# EAGLE design sensor_board (EAGLE 7.6.0)
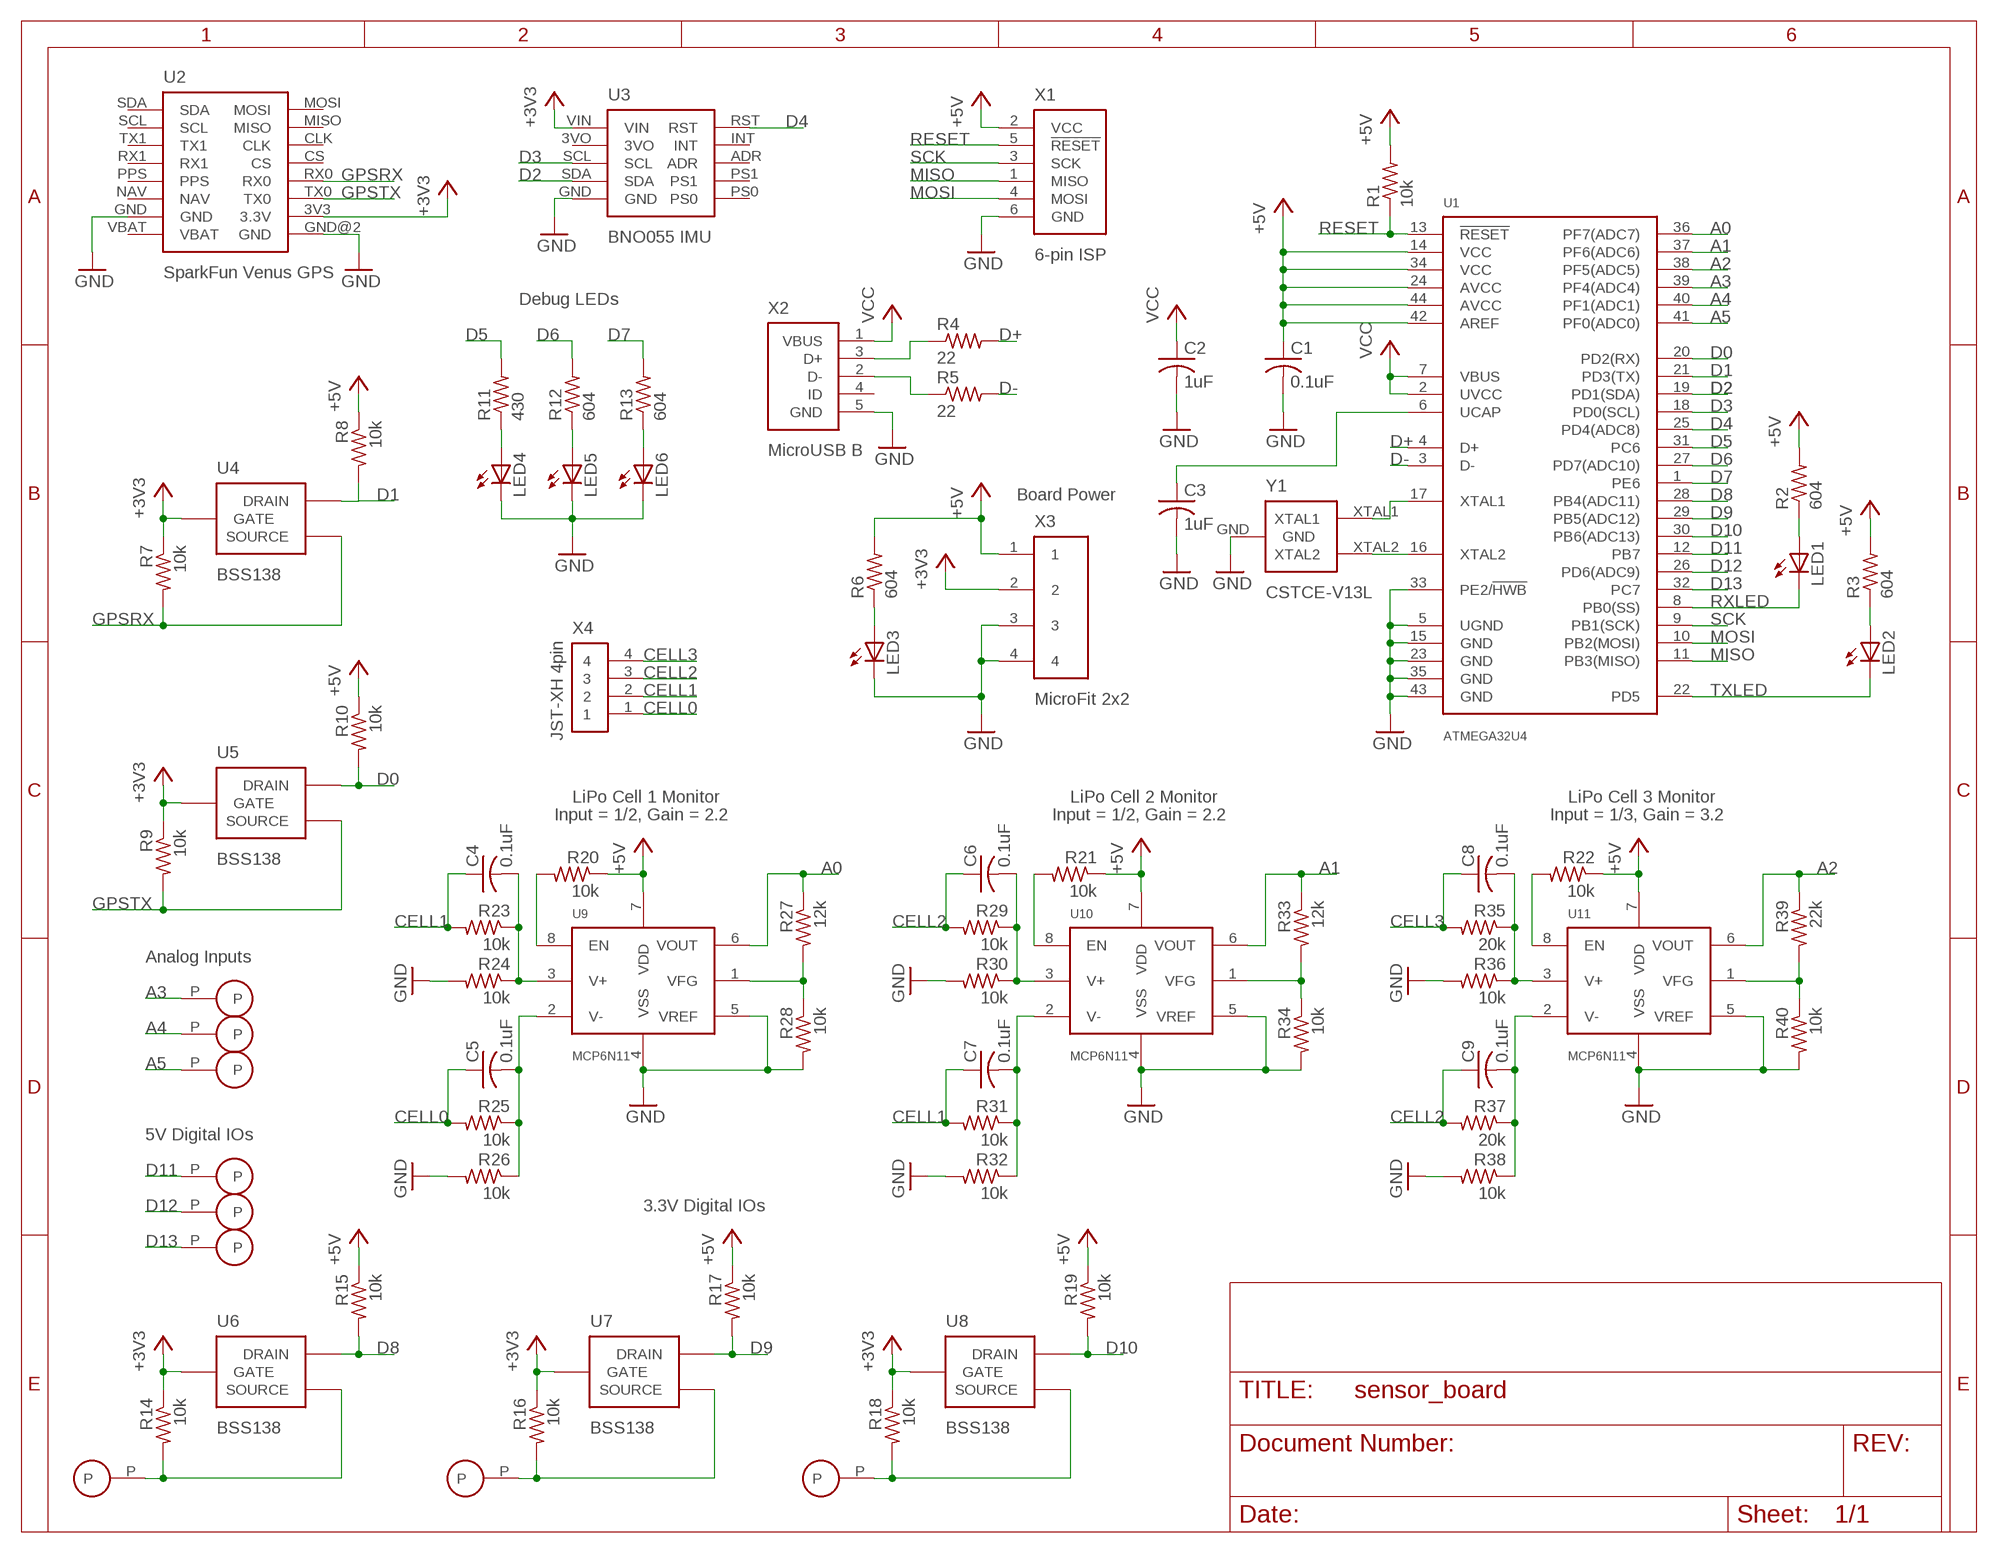
[diagram p0: schematic, sheet 1]

## Parts
C1  0.1uF  C-USC0603  [C0603]
C2  1uF  C-USC0603  [C0603]
C3  1uF  C-USC0603  [C0603]
C4  0.1uF  C-USC0603  [C0603]
C5  0.1uF  C-USC0603  [C0603]
C6  0.1uF  C-USC0603  [C0603]
C7  0.1uF  C-USC0603  [C0603]
C8  0.1uF  C-USC0603  [C0603]
C9  0.1uF  C-USC0603  [C0603]
LED1  LEDCHIPLED_0603  [CHIPLED_0603]
LED2  LEDCHIPLED_0603  [CHIPLED_0603]
LED3  LEDCHIPLED_0603  [CHIPLED_0603]
LED4  LEDCHIPLED_0603  [CHIPLED_0603]
LED5  LEDCHIPLED_0603  [CHIPLED_0603]
LED6  LEDCHIPLED_0603  [CHIPLED_0603]
P1  100MIL-PAD  [100MIL-PAD]
P2  100MIL-PAD  [100MIL-PAD]
P3  100MIL-PAD  [100MIL-PAD]
P4  100MIL-PAD  [100MIL-PAD]
P5  100MIL-PAD  [100MIL-PAD]
P6  100MIL-PAD  [100MIL-PAD]
P8  100MIL-PAD  [100MIL-PAD]
P9  100MIL-PAD  [100MIL-PAD]
P10  100MIL-PAD  [100MIL-PAD]
R1  10k  R-US_R0603  [R0603]
R2  604  R-US_R0603  [R0603]
R3  604  R-US_R0603  [R0603]
R4  22  R-US_R0603  [R0603]
R5  22  R-US_R0603  [R0603]
R6  604  R-US_R0603  [R0603]
R7  10k  R-US_R0603  [R0603]
R8  10k  R-US_R0603  [R0603]
R9  10k  R-US_R0603  [R0603]
R10  10k  R-US_R0603  [R0603]
R11  430  R-US_R0603  [R0603]
R12  604  R-US_R0603  [R0603]
R13  604  R-US_R0603  [R0603]
R14  10k  R-US_R0603  [R0603]
R15  10k  R-US_R0603  [R0603]
R16  10k  R-US_R0603  [R0603]
R17  10k  R-US_R0603  [R0603]
R18  10k  R-US_R0603  [R0603]
R19  10k  R-US_R0603  [R0603]
R20  10k  R-US_R0603  [R0603]
R21  10k  R-US_R0603  [R0603]
R22  10k  R-US_R0603  [R0603]
R23  10k  R-US_R0603  [R0603]
R24  10k  R-US_R0603  [R0603]
R25  10k  R-US_R0603  [R0603]
R26  10k  R-US_R0603  [R0603]
R27  12k  R-US_R0603  [R0603]
R28  10k  R-US_R0603  [R0603]
R29  10k  R-US_R0603  [R0603]
R30  10k  R-US_R0603  [R0603]
R31  10k  R-US_R0603  [R0603]
R32  10k  R-US_R0603  [R0603]
R33  12k  R-US_R0603  [R0603]
R34  10k  R-US_R0603  [R0603]
R35  20k  R-US_R0603  [R0603]
R36  10k  R-US_R0603  [R0603]
R37  20k  R-US_R0603  [R0603]
R38  10k  R-US_R0603  [R0603]
R39  22k  R-US_R0603  [R0603]
R40  10k  R-US_R0603  [R0603]
U1  ATMEGA32U4  [TQFP-44]
U2  SPARKFUN-VENUS-GPS  [SPARKFUN-VENUS-GPS]
U3  ADAFRUIT-BNO055-IMU  [ADAFRUIT-BNO055-IMU]
U4  BSS138  [SOT-23]
U5  BSS138  [SOT-23]
U6  BSS138  [SOT-23]
U7  BSS138  [SOT-23]
U8  BSS138  [SOT-23]
U9  MCP6N11  [SOIC-8]
U10  MCP6N11  [SOIC-8]
U11  MCP6N11  [SOIC-8]
X1  ISP-HEADER  [ISP-HEADER]
X2  MICRO-USB-B  [MICRO-USB-B]
X3  MICROFIT-2X2-SMD  [MICROFIT-2X2-0430450411]
X4  JST-XH-4  [JST-XH-4]
Y1  CSTCE-V13L  [CSTCE-V13L]

## Nets
3V3D8: P4.P R14.2 U6.SOURCE
3V3D9: P5.P R16.2 U7.SOURCE
3V3D10: P6.P R18.2 U8.SOURCE
+3V3: R7.1 R9.1 R14.1 R16.1 R18.1 U2.3V3(3.3V) U3.VIN U4.GATE U5.GATE U6.GATE U7.GATE U8.GATE X3.2
+5V: C1.1 R1.2 R2.2 R3.2 R6.2 R8.1 R10.1 R15.1 R17.1 R19.1 R20.1 R21.1 R22.1 U1.14(VCC) U1.24(AVCC) U1.34(VCC) U1.42(AREF) U1.44(AVCC) U9.7(VDD) U10.7(VDD) U11.7(VDD) X1.2(VCC) X3.1
A0: R27.1 U1.36(PF7(ADC7)) U9.6(VOUT)
A1: R33.1 U1.37(PF6(ADC6)) U10.6(VOUT)
A2: R39.1 U1.38(PF5(ADC5)) U11.6(VOUT)
A3: P8.P U1.39(PF4(ADC4))
A4: P9.P U1.40(PF1(ADC1))
A5: P10.P U1.41(PF0(ADC0))
CELL0: C5.1 R25.2 X4.1
CELL1: C4.1 C7.1 R23.2 R31.2 X4.2
CELL2: C6.1 C9.1 R29.2 R37.2 X4.3
CELL3: C8.1 R35.2 X4.4
D0: R10.2 U1.20(PD2(RX)) U5.DRAIN
D1: R8.2 U1.21(PD3(TX)) U4.DRAIN
D2: U1.19(PD1(SDA)) U3.SDA
D3: U1.18(PD0(SCL)) U3.SCL
D4: U1.25(PD4(ADC8)) U3.RST
D5: R11.2 U1.31(PC6)
D6: R12.2 U1.27(PD7(ADC10))
D7: R13.2 U1.1(PE6)
D8: R15.2 U1.28(PB4(ADC11)) U6.DRAIN
D9: R17.2 U1.29(PB5(ADC12)) U7.DRAIN
D10: R19.2 U1.30(PB6(ADC13)) U8.DRAIN
D11: P1.P U1.12(PB7)
D12: P2.P U1.26(PD6(ADC9))
D13: P3.P U1.32(PC7)
D+: R4.2 U1.4(D+)
D-: R5.2 U1.3(D-)
GND: C1.2 C2.2 C3.2 LED3.C LED4.C LED5.C LED6.C R24.2 R26.2 R28.2 R30.2 R32.2 R34.2 R36.2 R38.2 R40.2 U1.5(UGND) U1.15(GND) U1.23(GND) U1.33(PE2/!HWB!) U1.35(GND) U1.43(GND) U2.GND U2.GND@2(GND) U3.GND U9.4(VSS) U9.5(VREF) U10.4(VSS) U10.5(VREF) U11.4(VSS) U11.5(VREF) X1.6(GND) X2.5(GND) X3.3 X3.4 Y1.GND
GPSRX: R7.2 U2.RX0 U4.SOURCE
GPSTX: R9.2 U2.TX0 U5.SOURCE
MISO: U1.11(PB3(MISO)) X1.1(MISO)
MOSI: U1.10(PB2(MOSI)) X1.4(MOSI)
N$1: LED3.A R6.1
N$2: C3.1 U1.6(UCAP)
N$3: LED1.A R2.1
N$4: LED2.A R3.1
N$5: U1.16(XTAL2) Y1.XTAL2
N$6: U1.17(XTAL1) Y1.XTAL1
N$7: R20.2 U9.8(EN)
N$8: R5.1 X2.2(D-)
N$9: R4.1 X2.3(D+)
N$10: LED4.A R11.1
N$11: LED5.A R12.1
N$12: LED6.A R13.1
N$13: R21.2 U10.8(EN)
N$14: R22.2 U11.8(EN)
N$15: C4.2 R23.1 R24.1 U9.3(V+)
N$16: C8.2 R35.1 R36.1 U11.3(V+)
N$17: C5.2 R25.1 R26.1 U9.2(V-)
N$18: C6.2 R29.1 R30.1 U10.3(V+)
N$19: R27.2 R28.1 U9.1(VFG)
N$21: C7.2 R31.1 R32.1 U10.2(V-)
N$22: C9.2 R37.1 R38.1 U11.2(V-)
N$24: R33.2 R34.1 U10.1(VFG)
N$25: R39.2 R40.1 U11.1(VFG)
RESET: R1.1 U1.13(!RESET!) X1.5(!RESET!)
RXLED: LED1.C U1.8(PB0(SS))
SCK: U1.9(PB1(SCK)) X1.3(SCK)
TXLED: LED2.C U1.22(PD5)
VCC: C2.1 U1.2(UVCC) U1.7(VBUS) X2.1(VBUS)
Unconnected: U2.CLK U2.CS U2.MISO U2.MOSI U2.NAV U2.PPS U2.RX1 U2.SCL U2.SDA U2.TX1 U3.ADR U3.INT U3.PS0 U3.PS1 X2.4(ID)

## Notes on the sheet
- Debug LEDs
- Board Power
- LiPo Cell 1 Monitor | LiPo Cell 2 Monitor | LiPo Cell 3 Monitor
- Input = 1/2, Gain = 2.2 | Input = 1/2, Gain = 2.2 | Input = 1/3, Gain = 3.2
- Analog Inputs
- 5V Digital IOs
- 3.3V Digital IOs

## Power pins joined to a net without a drawn wire
3VO: U3.3VO
VBAT: U2.VBAT

## Library data of the parts
C1-C9 = resistor:C-US: CAPACITOR, American symbol
LED1-LED6 = led:LED: LED OSRAM: - CHIPLED LG R971, LG N971, LY N971, LG Q971, LY Q971, LO R971, LY R971 LH N974, LH R974 LS Q976, LO Q976, LY Q976 LO Q996 - Hyper CHIPLED LW Q18S LB Q993, LB Q99A, LB R99A - SideLED LS A670, LO A670, LY A670, LG A670, LP A670 LB A673, LV A673, LT A673, LW A673 LH A674 LY A675 LS A676, LA A676, LO A676, LY A676, LW A676 LS A679, LY A679, LG A679 - Hyper Micro SIDELED® LS Y876, LA Y876, LO Y876, LY Y876 LT Y87S - SmartLED LW L88C, LW L88S LB L89C, LB L89S, LG L890 LS L89K, LO L89K, LY L89K LS L896, LA L896, LO L896, LY L896 - TOPLED LS T670, LO T670, LY T670, LG T670, LP T670 LSG T670, LSP T670, LSY T670, LOP T670, LYG T670 LG T671, LOG T671, LSG T671 LB T673, LV T673, LT T673, LW T673 LH T674 LS T676, LA T676, LO T676, LY T676, LB T676, LH T676, LSB T676, LW T676 LB T67C, LV T67C, LT T67C, LS T67K, LO T67K, LY T67K, LW E67C LS E67B, LA E67B, LO E67B, LY E67B, LB E67C, LV E67C, LT E67C LW T67C LS T679, LY T679, LG T679 LS T770, LO T770, LY T770, LG T770, LP T770 LB T773, LV T773, LT T773, LW T773 LH T774 LS E675, LA E675, LY E675, LS T675 LS T776, LA T776, LO T776, LY T776, LB T776 LHGB T686 LT T68C, LB T68C - Hyper Mini TOPLED® LB M676 - Mini TOPLED Santana® LG M470 LS M47K, LO M47K, LY M47K Source: http://www.osram.convergy.de LUXEON: - LUMILED® LXK2-PW12-R00, LXK2-PW12-S00, LXK2-PW14-U00, LXK2-PW14-V00 LXK2-PM12-R00, LXK2-PM12-S00, LXK2-PM14-U00 LXK2-PE12-Q00, LXK2-PE12-R00, LXK2-PE12-S00, LXK2-PE14-T00, LXK2-PE14-U00 LXK2-PB12-K00, LXK2-PB12-L00, LXK2-PB12-M00, LXK2-PB14-N00, LXK2-PB14-P00, LXK2-PB14-Q00 LXK2-PR12-L00, LXK2-PR12-M00, LXK2-PR14-Q00, LXK2-PR14-R00 LXK2-PD12-Q00, LXK2-PD12-R00, LXK2-PD12-S00 LXK2-PH12-R00, LXK2-PH12-S00 LXK2-PL12-P00, LXK2-PL12-Q00, LXK2-PL12-R00 Source: www.luxeon.com KINGBRIGHT: KA-3528ASYC Source: www.kingbright.com
P1-P6 P8-P10 = rover12:100MIL-PAD
R1-R40 = resistor:R-US_: RESISTOR, American symbol
U1 = rover12:ATMEGA32U4
U2 = rover12:SPARKFUN-VENUS-GPS
U3 = rover12:ADAFRUIT-BNO055-IMU
U4-U8 = rover12:BSS138
U9-U11 = rover12:MCP6N11
X1 = rover12:ISP-HEADER
X2 = rover12:MICRO-USB-B
X3 = rover12:MICROFIT-2X2-SMD
X4 = rover12:JST-XH-4
Y1 = rover12:CSTCE-V13L

## Board
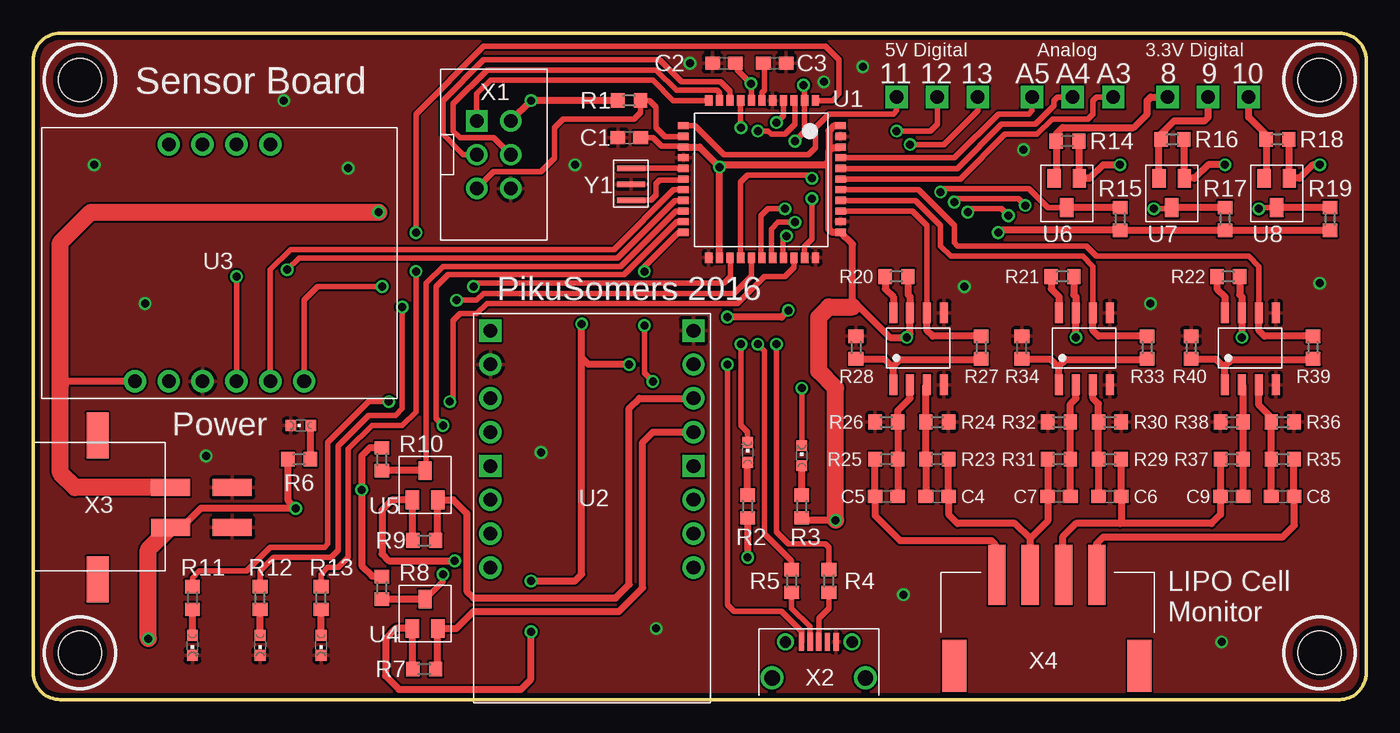
[diagram p1: board, top side]
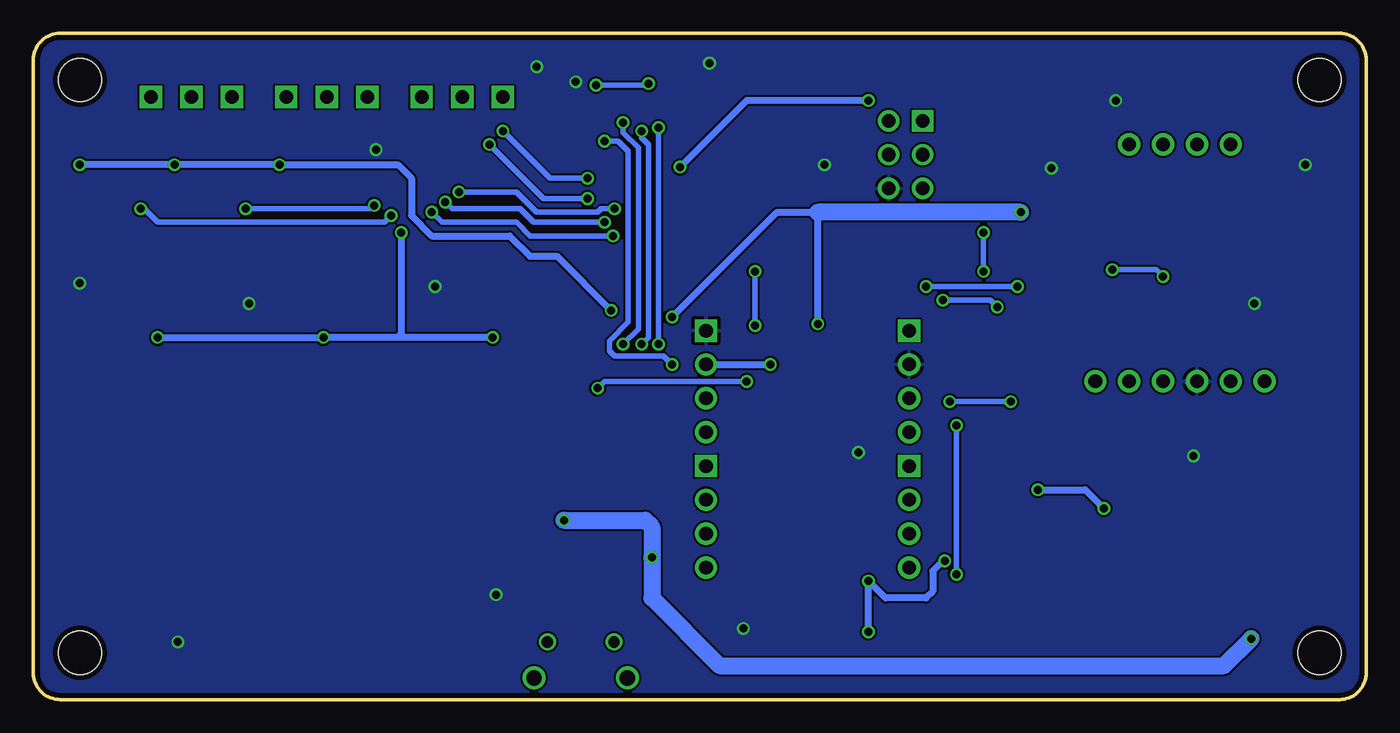
[diagram p2: board, bottom side, seen from below]

Size 100 x 50 mm. Coordinates in mm from the lower left corner, seen from the top.
Outline: 0,2 arc90 2,0 98,0 arc90 100,2 100,48 arc90 98,50 2,50 arc90 0,48 0,2
Copper layers (1*16): Top 0.0356mm / dielectric 1.5011mm / Bottom 0.0356mm
Design rules "oshpark-2layer": minimum track width 6mil, minimum drill 13mil, track to track 6mil, track to pad 6mil, pad to pad 6mil, via to via 6mil, smd to smd 6mil, copper to edge 15mil, drill to drill 6mil, minimum pad ring 7mil, minimum via ring 7mil, stop-mask expansion 2.5mil, vias tented up to drill 0mil, thermal gap 10mil
Holes 3.26 mm at 3.5,3.5 3.5,46.5 96.5,46.5 96.5,3.5

### Footprints (pad centres in the part's own frame; a part is rotated, then mirrored left to right if it is on the bottom)
C0603 = smd 1.1 x 1: 1 -0.85,0; 2 0.85,0
CHIPLED_0603 = smd 0.8 x 0.8: A 0,-0.75; C 0,0.75
100MIL-PAD = drill 1.016 pad 1.676 square: P 0,0
R0603 = smd 1 x 1.1: 1 -0.85,0; 2 0.85,0
TQFP-44 = smd 0.8 x 0.54: 1 0,0; 2 0,-0.8; 3 0,-1.6; 4 0,-2.4; 5 0,-3.2; 6 0,-4; 7 0,-4.8; 8 0,-5.6; 9 0,-6.4; 10 0,-7.2; 11 0,-8; 23 11.8,-8; 24 11.8,-7.2; 25 11.8,-6.4; 26 11.8,-5.6; 27 11.8,-4.8; 28 11.8,-4; 29 11.8,-3.2; 30 11.8,-2.4; 31 11.8,-1.6; 32 11.8,-0.8; 33 11.8,0 | smd 0.54 x 0.8: 12 1.9,-9.9; 13 2.7,-9.9; 14 3.5,-9.9; 15 4.3,-9.9; 16 5.1,-9.9; 17 5.9,-9.9; 18 6.7,-9.9; 19 7.5,-9.9; 20 8.3,-9.9; 21 9.1,-9.9; 22 9.9,-9.9; 34 9.9,1.9; 35 9.1,1.9; 36 8.3,1.9; 37 7.5,1.9; 38 6.7,1.9; 39 5.9,1.9; 40 5.1,1.9; 41 4.3,1.9; 42 3.5,1.9; 43 2.7,1.9; 44 1.9,1.9
SPARKFUN-VENUS-GPS = drill 1.016 pad 1.676: 3V3 0,2.54; CLK 0,12.7; GND@2 15.24,2.54; MISO 0,15.24; MOSI 0,17.78; NAV 15.24,5.08; PPS 15.24,7.62; RX0 0,7.62; SCL 15.24,15.24; SDA 15.24,17.78; TX0 0,5.08; TX1 15.24,12.7 | drill 1.016 pad 1.676 square: CS 0,10.16; GND 0,0; RX1 15.24,10.16; VBAT 15.24,0
ADAFRUIT-BNO055-IMU = drill 1.016 pad 1.676: 3VO 0,10.16; ADR 17.78,2.54; GND 0,7.62; INT 17.78,5.08; PS0 17.78,10.16; PS1 17.78,7.62; RST 0,0; SCL 0,2.54; SDA 0,5.08; VIN 0,12.7
SOT-23 = smd 1 x 1.4: DRAIN 0.95,2.2; GATE 0,0; SOURCE 1.9,0
SOIC-8 = smd 0.6 x 1.55: 1 0,0; 2 1.27,0; 3 2.54,0; 4 3.81,0; 5 3.81,5.4; 6 2.54,5.4; 7 1.27,5.4; 8 0,5.4
ISP-HEADER = drill 1.02 pad 1.6 square: 1 0,0 | drill 1.02 pad 1.6: 2 0,2.54; 3 2.54,0; 4 2.54,2.54; 5 5.08,0; 6 5.08,2.54
MICRO-USB-B = smd 0.4 x 1.35: 1 -1.3,0; 2 -0.65,0; 3 0,0; 4 0.65,0; 5 1.3,0 | drill 0.85 pad 1.25: NC1 -2.5,0; NC2 2.5,0 | drill 1.15 pad 1.55: NC3 -3.5,-2.7; NC4 3.5,-2.7
MICROFIT-2X2-0430450411 = smd 1.27 x 2.921: 1 6.896,5.474; 2 3.899,5.474; 3 6.896,10.097; 4 3.899,10.097 | smd 3.429 x 1.651: NC1 0,0; NC2 10.795,0
JST-XH-4 = smd 1.3 x 4.5: 1 3.2,6.8; 2 5.7,6.8; 3 8.2,6.8; 4 10.7,6.8 | smd 1.8 x 3.9: NC1 0,0; NC2 13.9,0
CSTCE-V13L = smd 0.4 x 2.1: GND 1.2,0; XTAL1 0,0; XTAL2 2.4,0

### Placement (x,y rotation side)
C1  44.7,42.16 180 top
C2  51.82,47.75 180 top
C3  55.63,47.75 0 top
C4  67.82,15.24 180 top
C5  64.01,15.24 0 top
C6  80.77,15.24 180 top
C7  76.96,15.24 0 top
C8  93.73,15.24 180 top
C9  89.92,15.24 0 top
LED1  53.59,18.54 0 top
LED2  57.66,18.29 0 top
LED3  20.07,20.57 90 top
LED4  11.94,4.06 180 top
LED5  17.02,4.06 180 top
LED6  21.59,4.06 180 top
P1  64.77,45.21 0 top
P2  67.82,45.21 0 top
P3  70.87,45.21 0 top
P4  85.09,45.21 0 top
P5  88.14,45.21 0 top
P6  91.19,45.21 0 top
P8  81.03,45.21 0 top
P9  77.98,45.21 0 top
P10  74.93,45.21 0 top
R1  44.7,44.96 180 top
R2  53.59,14.48 270 top
R3  57.66,14.48 270 top
R4  59.69,8.89 90 top
R5  56.9,8.89 90 top
R6  19.94,18.03 180 top
R7  29.34,2.29 0 top
R8  26.16,8.38 270 top
R9  29.34,11.94 0 top
R10  26.16,18.03 270 top
R11  11.94,7.62 90 top
R12  17.02,7.62 90 top
R13  21.59,7.62 90 top
R14  77.6,41.91 180 top
R15  81.53,36.07 90 top
R16  85.47,42.04 180 top
R17  89.41,36.07 90 top
R18  93.34,42.04 180 top
R19  97.28,36.07 90 top
R20  64.77,31.75 180 top
R21  77.22,31.75 180 top
R22  89.66,31.75 180 top
R23  67.82,18.03 0 top
R24  67.82,20.83 0 top
R25  64.01,18.03 180 top
R26  64.01,20.83 180 top
R27  71.12,26.42 270 top
R28  61.72,26.42 90 top
R29  80.77,18.03 0 top
R30  80.77,20.83 0 top
R31  76.96,18.03 180 top
R32  76.96,20.83 180 top
R33  83.57,26.42 270 top
R34  74.17,26.42 90 top
R35  93.73,18.03 0 top
R36  93.73,20.83 0 top
R37  89.92,18.03 180 top
R38  89.92,20.83 180 top
R39  96.01,26.42 270 top
R40  86.87,26.42 90 top
U1  58.67,44.96 270 top
U2  49.53,27.69 180 top
U3  20.32,23.88 90 top
U4  28.45,5.33 0 top
U5  28.45,14.99 0 top
U6  78.49,39.12 180 top
U7  86.36,39.12 180 top
U8  94.23,39.12 180 top
U9  64.52,23.62 0 top
U10  76.96,23.62 0 top
U11  89.41,23.62 0 top
X1  33.27,43.43 270 top
X2  58.93,4.32 0 top
X3  4.83,19.81 270 top
X4  69.09,2.54 0 top
Y1  44.83,37.47 90 top

### Tracks (layer width: path | path; a pad name or v marks a point on that pad's centre or on a via)
3V3D8
  Top 0.508: U6.SOURCE 76.75,39.28 R14.2 76.75,42.46 77.22,42.93 82.55,42.93 83.57,43.94 83.57,44.96 83.82,45.21 P4.P
3V3D9
  Top 0.508: U7.SOURCE 84.46,41.88 R16.2 84.62,42.46 85.6,43.43 87.88,43.43 88.14,43.69 P5.P
3V3D10
  Top 0.508: U8.SOURCE 92.5,39.28 R18.2 92.5,42.38 91.19,43.69 P6.P
+3V3  (via drill 0.6)
  Top 0.508: R7.1 28.45,2.29 U4.GATE 27.18,5.33 26.42,4.57 26.42,1.78 27.43,0.76 36.58,0.76 37.34,1.52 v37.34,5.08 | R9.1 28.45,11.94 U5.GATE 26.92,14.99 26.16,14.22 26.16,10.92 26.67,10.41 v31.62,10.41 | R18.1 94.23,42 U8.GATE 95,39.12 96.01,40.13 v96.52,40.13 | R16.1 86.36,42 U7.GATE 87.12,39.12 88.14,40.13 v89.41,40.13 | R14.1 78.45,39.16 | 78.45,39.16 U6.GATE 79.25,39.12 79.29,39.16 | 78.45,39.16 79.29,39.16 | 79.29,39.16 80.26,40.13 v81.53,40.13 | v44.7,25.15 41.66,25.15 41.15,25.65 | 41.15,25.65 v41.15,28.19 | v37.34,8.89 40.64,8.89 41.15,9.4 41.15,25.65 | U3.VIN 2.29,23.88 2.03,23.62 | v56.64,29.21 56.13,28.7 v52.07,28.7
  Top 1.27: X3.2 3.14,15.91 2.03,17.02 2.03,23.62 2.03,34.29 4.32,36.58 v25.91,36.58
  Bottom 0.508: v96.52,40.13 v89.41,40.13 v81.53,40.13 72.64,40.13 71.63,39.12 71.63,36.32 70.1,34.8 64.26,34.8 62.74,33.27 60.71,33.27 v56.64,29.21 | U2.3V3 v44.7,25.15 | v41.15,28.19 41.15,36.32 | 41.15,36.32 41.15,36.58 | v31.62,10.41 31.75,10.41 32.51,9.65 32.51,8.13 33.02,7.62 36.07,7.62 v37.34,8.89 v37.34,5.08 | v52.07,28.7 44.2,36.58 41.4,36.58 41.15,36.32
  Bottom 1.27: v25.91,36.58 41.15,36.58
+5V  (via drill 0.6)
  Top 0.406: C1.1 46.48,42.16 47.12,41.53 48.7,41.53 U1.14
  Top 0.508: R20.1 65.62,30.39 65.79,30.23 U9.7 65.79,27.43 v65.53,27.18 64.26,27.18 61.98,29.46 61.47,29.46 61.47,34.16 U1.34 59.94,35.06 59.69,35.31 59.69,40.39 | R21.1 78.07,30.39 78.23,30.23 U10.7 v78.23,27.18 | R10.1 25.23,18.88 24.64,18.29 v24.64,15.75 24.64,10.03 25.4,9.27 26.12,9.27 R8.1 | X3.1 10.34,12.95 11.18,12.95 12.57,14.35 v19.68,14.35 19.09,14.95 R6.2 | R2.2 v53.59,10.67 | R19.1 R17.1 R15.1 72.56,35.22 v72.39,35.05 | R22.1 90.51,30.39 90.68,30.23 U11.7 v90.68,27.18 | 59.69,40.39 59.69,41.15 | 59.69,41.15 59.94,41.4 60.52,41.4 U1.42 | U1.44 60.08,43.06 59.69,42.67 59.69,41.15 | U1.14 49.98,41.46 51.31,40.13 | 51.31,40.13 59.44,40.13 59.69,40.39 | U1.24 v51.47,39.97 51.31,40.13 | R1.2 v37.34,44.96 X1.2 | v60.2,13.46 57.82,13.46 R3.2
  Top 1.27: v8.64,4.57 8.64,11.25 X3.1 | v60.2,13.46 60.2,23.37 58.93,24.64 58.93,28.7 59.69,29.46 61.47,29.46
  Bottom 0.508: v24.64,15.75 21.08,15.75 v19.68,14.35 | v65.53,27.18 72.64,27.18 | 72.64,27.18 v78.23,27.18 v90.68,27.18 | v72.39,35.05 72.39,27.43 72.64,27.18 | v37.34,44.96 46.48,44.96 v51.47,39.97
  Bottom 1.27: v8.64,4.57 10.67,2.54 48.51,2.54 53.59,7.62 v53.59,10.67 53.59,12.95 54.1,13.46 v60.2,13.46
A0
  Top 0.406: U1.36 65.96,36.66 67.06,35.56 U9.6
  Top 0.508: R27.1 67.48,27.27 67.06,27.69 U9.6
A1
  Top 0.406: U1.37 66.17,37.46 68.07,35.56 68.07,34.04 68.83,33.27 78.74,33.27 79.5,32.51 U10.6
  Top 0.508: R33.1 79.92,27.27 79.5,27.69 U10.6
A2
  Top 0.406: U1.38 66.39,38.26 69.09,35.56 69.09,34.29 69.34,34.04 78.99,34.04 79.76,33.27 91.19,33.27 91.95,32.51 U11.6
  Top 0.508: R39.1 92.37,27.27 91.95,27.69 U11.6
A3
  Top 0.406: U1.39 69.54,39.06 72.9,42.42 75.31,42.42 76.45,43.56 79.12,43.56 79.5,43.94 79.5,44.96 79.76,45.21 P8.P
A4
  Top 0.406: U1.40 69.32,39.86 72.64,43.18 75.18,43.18 76.58,44.58 76.58,44.96 76.83,45.21 P9.P
A5
  Top 0.406: U1.41 69.11,40.66 72.39,43.94 74.68,43.94 74.93,44.2 P10.P
CELL0
  Top 0.508: X4.1 72.14,9.49 72.14,11.68 71.88,11.94 65.02,11.94 63.16,13.8 C5.1 R25.2
CELL1
  Top 0.508: X4.2 74.79,12.08 | 74.79,12.08 73.66,13.21 69.34,13.21 68.71,13.84 68.71,15.2 C4.1 R23.2 | 74.79,12.08 76.11,13.4 C7.1 R31.2
CELL2
  Top 0.508: 81.53,13.21 88.39,13.21 89.07,13.88 C9.1 R37.2 | 81.53,13.21 78.23,13.21 77.22,12.19 77.22,9.41 X4.3 | 81.53,13.21 81.62,13.3 C6.1 R29.2
CELL3
  Top 0.508: X4.4 79.79,11.72 80.26,12.19 93.73,12.19 94.61,13.08 94.61,15.2 C8.1 R35.2
D0
  Top 0.406: U1.20 48.22,36.66 44.07,32.51 30.73,32.51 29.46,31.24 29.46,17.25 U5.DRAIN
  Top 0.508: U5.DRAIN R10.2
D1  (via drill 0.6)
  Top 0.406: U1.21 48.3,35.86 44.32,31.88 31.11,31.88 30.23,30.99 30.23,21.08 v30.73,20.57 | v30.73,9.4 30.73,8.87 U4.DRAIN
  Top 0.508: U4.DRAIN R8.2
  Bottom 0.406: v30.73,20.57 v30.73,9.4
D2  (via drill 0.6)
  Top 0.406: U1.19 48.13,37.46 43.81,33.15 19.94,33.15 v19.05,32.26 | v15.24,31.75 U3.SDA
  Bottom 0.406: v19.05,32.26 15.75,32.26 v15.24,31.75
D3
  Top 0.406: U1.18 48.04,38.26 43.56,33.78 19.3,33.78 17.78,32.26 U3.SCL
D4  (via drill 0.6)
  Top 0.406: U3.RST 20.32,29.97 21.34,30.99 v26.16,30.99 | U1.25 52.32,33.11 52.32,31.75 51.82,31.24 33.27,31.24 v33.02,30.99
  Bottom 0.406: v26.16,30.99 v33.02,30.99
D5  (via drill 0.6)
  Top 0.406: U1.31 57.07,32.44 56.39,31.75 54.86,31.75 52.83,29.72 34.04,29.72 33.27,28.96 32,28.96 31.5,28.45 31.5,22.61 v31.24,22.35 | v26.67,22.35 25.15,22.35 22.1,19.3 22.1,11.68 21.84,11.43 17.78,11.43 16,9.65 12.45,9.65 11.94,9.14 R11.2
  Bottom 0.406: v31.24,22.35 v26.67,22.35
D6  (via drill 0.6)
  Top 0.406: U1.27 53.87,31.78 52.58,30.48 33.78,30.48 33.27,29.97 v31.75,29.97 | v27.69,29.46 27.69,21.84 27.18,21.34 25.15,21.34 22.86,19.05 22.86,11.18 22.35,10.67 18.03,10.67 17.02,9.65 R12.2
  Bottom 0.406: v31.75,29.97 28.19,29.97 v27.69,29.46
D7  (via drill 0.6)
  Top 0.406: v28.7,35.05 28.7,43.94 33.78,49.02 59.44,49.02 60.45,48.01 60.45,45.47 59.94,44.96 U1.1 | v28.7,32.13 28.7,21.59 27.69,20.57 25.4,20.57 23.62,18.8 23.62,10.67 22.86,9.91 22.1,9.91 21.59,9.4 R13.2
  Bottom 0.406: v28.7,35.05 v28.7,32.13
D8  (via drill 0.6)
  Top 0.406: U6.DRAIN 76.11,36.92 74.68,38.35 68.33,38.35 v68.07,38.1 | v56.39,36.83 55.12,36.83 54.61,36.32 54.61,33.22 U1.28
  Top 0.508: R15.2 U6.DRAIN
  Bottom 0.406: v68.07,38.1 63.75,38.1 62.23,36.58 57.66,36.58 57.4,36.83 v56.39,36.83
D9  (via drill 0.6)
  Top 0.406: v74.42,37.08 73.91,37.59 69.34,37.59 v69.09,37.34 | v84.07,36.83 85.32,36.83 U7.DRAIN | v57.15,35.81 55.88,35.81 55.37,35.31 55.37,33.26 U1.29
  Top 0.508: R17.2 U7.DRAIN
  Bottom 0.406: v84.07,36.83 74.68,36.83 v74.42,37.08 | v69.09,37.34 68.58,36.83 63.5,36.83 62.48,35.81 v57.15,35.81
D10  (via drill 0.6)
  Top 0.406: v91.95,36.83 92.04,36.92 U8.DRAIN | v73.15,36.32 72.64,36.83 70.36,36.83 v70.1,36.58 | v56.52,34.8 56.26,34.54 U1.30
  Top 0.508: R19.2 U8.DRAIN
  Bottom 0.406: v91.95,36.83 91.69,36.83 90.68,35.81 73.66,35.81 v73.15,36.32 | v70.1,36.58 69.34,35.81 63.75,35.81 62.74,34.8 v56.52,34.8
D11
  Top 0.406: U1.12 49.65,43.06 51.82,40.89 58.17,40.89 58.67,41.4 58.67,42.93 59.69,43.94 64.52,43.94 64.77,44.2 P1.P
D12  (via drill 0.6)
  Top 0.406: U1.26 53.07,38.85 53.59,39.37 58.17,39.37 v58.42,39.12 | v64.77,42.67 67.31,42.67 67.82,43.18 P2.P
  Bottom 0.406: v58.42,39.12 61.21,39.12 v64.77,42.67
D13  (via drill 0.6)
  Top 0.406: v65.79,41.66 68.33,41.66 70.87,44.2 P3.P | U1.32 57.87,34 58.42,34.54 v58.42,37.59
  Bottom 0.406: v58.42,37.59 61.72,37.59 v65.79,41.66
D+  (via drill 0.6)
  Top 0.406: U1.4 56.27,43.83 v55.75,43.31 | v55.75,26.67 55.75,12.57 56.64,11.68 59.44,11.68 59.69,11.43 R4.2
  Bottom 0.406: v55.75,43.31 55.75,42.55 54.61,41.4 54.61,27.81 v55.75,26.67
D-  (via drill 0.6)
  Top 0.406: v54.36,26.67 54.86,26.16 54.86,12.45 56.9,10.41 R5.2 | U1.3 57.15,44.88 57.15,43.18 56.39,42.42 55.37,42.42 55.12,42.67 v54.36,42.67
  Bottom 0.406: v54.36,42.67 54.36,42.16 53.85,41.66 53.85,27.18 v54.36,26.67
GND  (via drill 0.6)
  other vias: 59.31,46.35 49.28,47.75 18.8,44.96 23.62,39.88 4.57,40.13 8.38,29.72 12.95,18.29 46.74,5.33 38.1,18.54 65.28,7.87 89.15,4.32 69.85,30.99 83.82,29.72 96.52,31.24 74.3,41.27 62.23,47.5 40.64,40.13
  pour Top: 2.03,50.04 arc90 0,48.01 0,47.24 0,1.78 arc90 1.78,0 3.3,0 97.79,0 arc90 100.08,2.29 100.08,3.56 100.08,48.01 arc90 98.04,50.04 97.03,50.04
  pour Bottom: 2.03,50.04 arc90 0,48.01 0,47.24 0,1.78 arc90 1.78,0 3.3,0 97.79,0 arc90 100.08,2.29 100.08,3.56 100.08,48.01 arc90 98.04,50.04 97.03,50.04
GPSRX
  Top 0.508: R7.2 30.35,2.29 U4.SOURCE 31.75,5.33 33.02,6.6 43.94,6.6 45.72,8.38 45.72,19.3 46.48,20.07 U2.RX0
GPSTX
  Top 0.508: R9.2 30.35,11.94 U5.SOURCE 31.5,14.99 32.51,13.97 32.51,8.13 33.02,7.62 43.69,7.62 44.7,8.64 44.7,21.84 45.47,22.61 U2.TX0
MISO
  Top 0.406: U1.11 48.01,44.96 46.48,46.48 34.29,46.48 33.27,45.47 X1.1
MOSI
  Top 0.406: U1.10 51.47,45.55 51.31,45.72 48.26,45.72 46.74,47.24 34.04,47.24 31.5,44.7 31.5,42.67 32,42.16 34.54,42.16 X1.4
N$1
  Top 0.508: R6.1 20.82,18.03 LED3.A
N$2
  Top 0.406: 54.67,47.65 C3.1 54.86,47.66 54.86,45.72 54.67,45.53 U1.6
N$3
  Top 0.508: R2.1 LED1.A
N$4
  Top 0.508: R3.1 LED2.A
N$5
  Top 0.406: Y1.XTAL2 U1.16
N$6
  Top 0.406: Y1.XTAL1 46.35,37.47 46.74,37.85 46.74,38.73 46.99,38.99 48.7,38.99 U1.17
N$7
  Top 0.508: R20.2 63.92,30.82 64.52,30.23 U9.8
N$8
  Top 0.406: X2.2 58.28,5.48 56.9,6.86 R5.1
N$9
  Top 0.406: X2.3 58.93,6.1 59.69,6.86 R4.1
N$10
  Top 0.508: LED4.A R11.1
N$11
  Top 0.508: LED5.A R12.1
N$12
  Top 0.508: LED6.A R13.1
N$13
  Top 0.508: R21.2 76.37,30.82 76.96,30.23 U10.8
N$14
  Top 0.508: R22.2 88.81,30.82 89.41,30.23 U11.8
N$15
  Top 0.508: C4.2 R23.1 R24.1 66.97,23.53 U9.3
N$16
  Top 0.508: C8.2 R35.1 R36.1 92.88,21.17 91.95,22.1 U11.3
N$17
  Top 0.508: C5.2 R25.1 R26.1 64.86,21.68 65.79,22.61 U9.2
N$18
  Top 0.508: C6.2 R29.1 R30.1 79.92,22.19 79.5,22.61 U10.3
N$19
  Top 0.508: R28.1 61.76,25.53 63.88,25.53 64.52,24.89 U9.1 64.52,25.02 65.02,25.53 71.08,25.53 R27.2
N$21
  Top 0.508: C7.2 R31.1 R32.1 77.81,22.19 78.23,22.61 U10.2
N$22
  Top 0.508: U11.2 90.77,23.53 R38.1 R37.1 C9.2
N$24
  Top 0.508: R34.1 74.21,25.53 76.33,25.53 76.96,24.89 U10.1 76.96,25.02 77.47,25.53 83.53,25.53 R33.2
N$25
  Top 0.508: R40.1 86.91,25.53 88.77,25.53 89.41,24.89 U11.1 89.41,25.02 89.92,25.53 95.97,25.53 R39.2
RESET
  Top 0.406: U1.13 47.4,42.26 46.74,42.93 46.74,44.45 46.23,44.96 R1.1 45.55,44.03 45.09,43.56 39.75,43.56 39.12,42.93 39.12,40.64 38.1,39.62 34.54,39.62 X1.5
RXLED  (via drill 0.6)
  Top 0.406: U1.8 53.07,43.7 v53.09,42.93 | v53.09,26.67 53.09,20.57 53.59,20.07 LED1.C
  Bottom 0.406: v53.09,42.93 v53.09,26.67
SCK
  Top 0.406: U1.9 52.27,45.64 51.56,46.35 48.64,46.35 46.99,48.01 33.78,48.01 30.73,44.96 30.73,42.42 32.26,40.89 X1.3
TXLED  (via drill 0.6)
  Top 0.406: U1.22 48.39,35.06 45.85,32.51 v45.85,32.13 | v45.85,28.07 45.85,24.51 v46.48,23.88 | v57.66,23.37 LED2.C
  Bottom 0.406: v45.85,32.13 v45.85,28.07 | v46.48,23.88 57.15,23.88 v57.66,23.37
VCC  (via drill 0.6)
  Top 0.406: U1.7 53.87,46.2 v53.85,46.23 52.83,47.24 52.83,47.59 C2.1 | v57.78,46.1 57.87,46.01 U1.2 57.87,42.63 v57.15,41.91 | v52.07,25.15 52.07,7.11 52.58,6.6 56.13,6.6 57.66,5.08 57.66,4.35 X2.1
  Bottom 0.406: v57.78,46.1 53.98,46.1 v53.85,46.23 | v52.07,25.15 52.7,25.78 56.39,25.78 56.77,26.16 56.77,26.92 55.37,28.32 55.37,41.15 56.13,41.91 v57.15,41.91

### Text on the board
tPlace: 5V Digital | Analog | 3.3V Digital | 11 | 12 | 13 | A5 | A4 | A3 | 8 | 9 | 10 | Sensor Board | PikuSomers 2016 | Power | LIPO Cell / Monitor